# EAGLE design TiltyDuo (EAGLE 6.5.0)
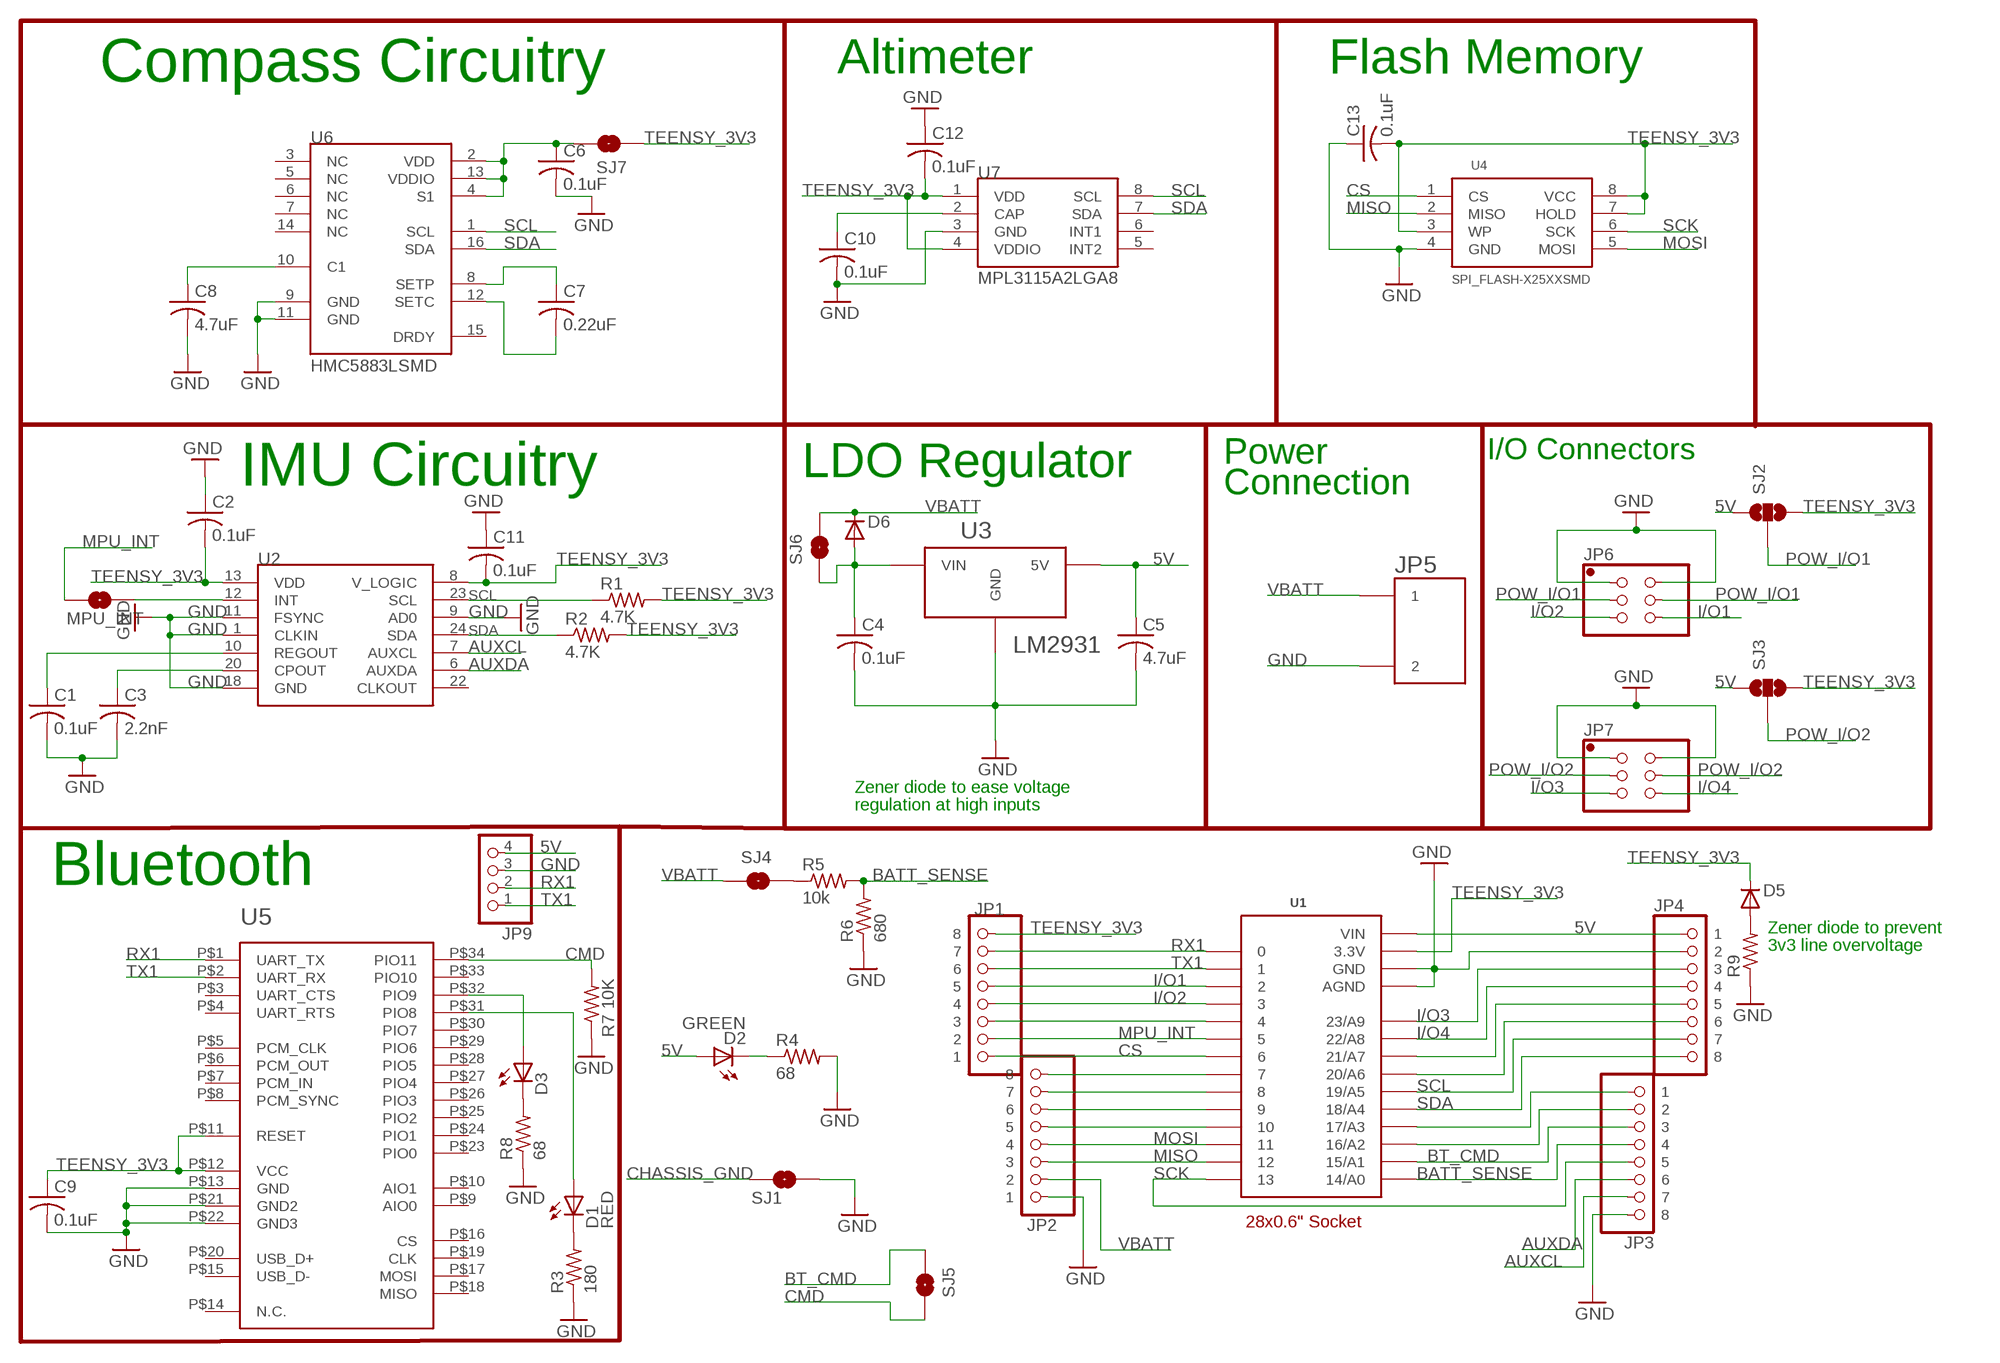
[diagram p0: schematic, sheet 1]

## Parts
C1  0.1uF  C-USC0603  [C0603]
C2  0.1uF  C-USC0603  [C0603]
C3  2.2nF  C-USC0603  [C0603]
C4  0.1uF  C-USC0603  [C0603]
C5  4.7uF  C-USC0603  [C0603]
C6  0.1uF  C-USC0603  [C0603]
C7  0.22uF  C-USC0603  [C0603]
C8  4.7uF  C-USC0603  [C0603]
C9  0.1uF  C-USC0603  [C0603]
C10  0.1uF  C-USC0603  [C0603]
C11  0.1uF  C-USC0603  [C0603]
C12  0.1uF  C-USC0603  [C0603]
C13  0.1uF  C-USC0603  [C0603]
D1  RED  LED-GREENLED-0805_NO_SILK  [LED-0805]
D2  GREEN  LED-GREENLED-0805_NO_SILK  [LED-0805]
D3  YELLOW  LED-GREENLED-0805_NO_SILK  [LED-0805]
D5  DIODESOT23  [SOT23-3]
D6  DIODE-DO214AA  [DO214AA]
JP1  8-PIN_HEADER  [8-PIN_RECEPTACLE_LOCK_NO-SS]
JP2  8-PIN_HEADER  [8-PIN_RECEPTACLE_LOCK_NO-SS]
JP3  8-PIN_HEADER  [8-PIN_RECEPTACLE_LOCK_NO-SS]
JP4  8-PIN_HEADER  [8-PIN_RECEPTACLE_LOCK_NO-SS]
JP5  2-POS_SMD_TERM_BLOCK  [2-POS_SMD_TERMINAL_BLOCK]
JP6  PINHD-2X32X03_NO_SS_LOCK  [2X03_NO_SS_LOCK]
JP7  PINHD-2X32X03_NO_SS_LOCK  [2X03_NO_SS_LOCK]
JP9  PINHD-1X41X04_NO_SS_LOCKING  [1X04_NO_SS_LOCKING]
MPU_INT  SOLDERJUMPERNO  [SJ_2S-NO]
R1  4.7K  R-US_R0603  [R0603]
R2  4.7K  R-US_R0603  [R0603]
R3  180  R-US_R0603  [R0603]
R4  68  R-US_R0603  [R0603]
R5  10k  R-US_R0603  [R0603]
R6  680  R-US_R0603  [R0603]
R7  10K  R-US_R0603  [R0603]
R8  68  R-US_R0603  [R0603]
R9  R-US_R0603  [R0603]
SJ1  SOLDERJUMPERNO  [SJ_2S-NO]
SJ2  SOLDERJUMPER_2WAYPASTE1&2  [SJ_3_PASTE1&2]
SJ3  SOLDERJUMPER_2WAYS  [SJ_3]
SJ4  SOLDERJUMPERTRACE  [SJ_2S-TRACE]
SJ5  SOLDERJUMPERTRACE  [SJ_2S-TRACE]
SJ6  SOLDERJUMPERTRACE  [SJ_2S-TRACE]
SJ7  SOLDERJUMPERTRACE  [SJ_2S-TRACE]
U1  TEENSY_3.0_OUTER-PINS28-DIP_SOCKET  [28-DIP]
U2  MPU-6050  [QFN-24]
U3  LM2931  [TO263]
U4  SPI_FLASH-X25XXSMD  [SO08]
U5  HC-09_BREAKOUT  [HC-09_BREAKOUT]
U6  HMC5883LSMD  [16LPCC]
U7  MPL3115A2LGA8  [LGA8]

## Nets
5V: C5.1 D2.1(A) JP4.P$1 JP9.4 SJ2.1 SJ3.1 U1.P$15(VIN) U3.P$3(5V)
AUXCL [I/O]: JP3.P$7 U2.7(AUXCL)
AUXDA [I/O]: JP3.P$6 U2.6(AUXDA)
BATT_SENSE: JP3.P$4 R5.2 R6.2 U1.P$27(14/A0)
BT_CMD: JP3.P$3 SJ5.1 U1.P$26(15/A1)
CHASSIS_GND: SJ1.1
CMD: R7.2 SJ5.2 U5.P$34(PIO11)
CS: JP1.P$1 U1.P$8 U4.1(CS)
GND: C1.2 C2.1 C3.2 C4.2 C5.2 C6.2 C8.2 C9.2 C10.2 C11.1 C12.1 C13.1 JP2.P$1 JP3.P$8 JP4.P$2 JP5.P$4 JP6.1 JP6.2 JP7.1 JP7.2 JP9.3 R3.1 R4.2 R6.1 R7.1 R8.1 R9.1 SJ1.2 U1.P$1(GND) U1.P$16(AGND) U2.1(CLKIN) U2.9(AD0) U2.11(FSYNC) U2.18(GND) U3.P$1(GND) U4.4(GND) U5.P$13(GND) U5.P$21(GND2) U5.P$22(GND3) U6.9(GND) U6.11(GND) U7.3(GND)
I/O1: JP1.P$5 JP6.6 U1.P$4
I/O2: JP1.P$4 JP6.5 U1.P$5
I/O3: JP4.P$3 JP7.5 U1.P$18(23/A9)
I/O4: JP4.P$4 JP7.6 U1.P$19(22/A8)
MISO: JP2.P$3 U1.P$14 U4.2(MISO)
MOSI: JP2.P$4 U1.P$13 U4.5(MOSI)
MPU_INT: JP1.P$2 MPU_INT.1 U1.P$7
N$1: C1.1 U2.10(REGOUT)
N$2: C3.1 U2.20(CPOUT)
N$3: D1.2(C) R3.2
N$5: C7.1 U6.8(SETP)
N$6: C7.2 U6.12(SETC)
N$7: JP1.P$3 U1.P$6
N$8: JP2.P$5 U1.P$12
N$9: R5.1 SJ4.2
N$10: JP3.P$1 U1.P$24(17/A3)
N$11: C8.1 U6.10(C1)
N$12: JP2.P$6 U1.P$11
N$13: D2.2(C) R4.1
N$14: D1.1(A) U5.P$31(PIO8)
N$16: MPU_INT.2 U2.12(INT)
N$17 [3.3V]: C6.1 SJ7.2 U6.2(VDD) U6.4(S1) U6.13(VDDIO)
N$18: JP4.P$5 U1.P$20(21/A7)
N$19: JP4.P$6 U1.P$21(20/A6)
N$21: C10.1 U7.2(CAP)
N$22: D5.1(A) R9.2
N$23: JP3.P$2 U1.P$25(16/A2)
N$24: D3.2(C) R8.2
POW_I/O1: JP6.3 JP6.4 SJ2.2
POW_I/O2: JP7.3 JP7.4 SJ3.2
RX1: JP1.P$7 JP9.2 U1.P$2 U5.P$1(UART_TX)
RX3: JP2.P$8 U1.P$9
SCK: JP3.P$5 U1.P$28 U4.6(SCK)
SCL [I/O]: JP4.P$7 R1.1 U1.P$22(19/A5) U2.23(SCL) U6.1(SCL) U7.8(SCL)
SDA [I/O]: JP4.P$8 R2.1 U1.P$23(18/A4) U2.24(SDA) U6.16(SDA) U7.7(SDA)
TEENSY_3V3 [3.3V]: C2.2 C9.1 C11.2 C12.2 C13.2 D5.3(C) JP1.P$8 R1.2 R2.2 SJ2.3 SJ3.3 SJ7.1 U1.P$17(3.3V) U2.8(V_LOGIC) U2.13(VDD) U4.3(WP) U4.7(HOLD) U4.8(VCC) U5.P$11(RESET) U5.P$12(VCC) U7.1(VDD) U7.4(VDDIO)
TX1: JP1.P$6 JP9.1 U1.P$3 U5.P$2(UART_RX)
TX3: JP2.P$7 U1.P$10
VBATT: C4.1 D6.A D6.C JP2.P$2 JP5.P$3 SJ4.1 SJ6.1 SJ6.2 U3.P$2(VIN)
YEL_LED: D3.1(A) U5.P$32(PIO9)
Unconnected: U2.22(CLKOUT) U5.P$3(UART_CTS) U5.P$4(UART_RTS) U5.P$5(PCM_CLK) U5.P$6(PCM_OUT) U5.P$7(PCM_IN) U5.P$8(PCM_SYNC) U5.P$9(AIO0) U5.P$10(AIO1) U5.P$14(N.C.) U5.P$15(USB_D-) U5.P$16(CS) U5.P$17(MOSI) U5.P$18(MISO) U5.P$19(CLK) U5.P$20(USB_D+) U5.P$23(PIO0) U5.P$24(PIO1) U5.P$25(PIO2) U5.P$26(PIO3) U5.P$27(PIO4) U5.P$28(PIO5) U5.P$29(PIO6) U5.P$30(PIO7) U5.P$33(PIO10) U6.3(NC) U6.5(NC) U6.6(NC) U6.7(NC) U6.14(NC) U6.15(DRDY) U7.5(INT2) U7.6(INT1)

## Notes on the sheet
- Compass Circuitry | Altimeter | Flash Memory
- Power | I/O Connectors
- IMU Circuitry | LDO Regulator
- Connection
- Zener diode to ease voltage
- regulation at high inputs
- Bluetooth
- Zener diode to prevent
- 3v3 line overvoltage
- 28x0.6" Socket

## Library data of the parts
C1 C6 C9 C10 C13 = resistor:C-US: CAPACITOR, American symbol; RATED_VOLTAGE: 2
C2 C4 C5 C11 C12 = resistor:C-US: CAPACITOR, American symbol
C3 = resistor:C-US: CAPACITOR, American symbol; RATED_VOLTAGE: 50
C7 C8 = resistor:C-US: CAPACITOR, American symbol; ESR: <200mOhms
D1-D3 = SparkFun-LED:LED-GREEN: Various green LEDs 0603- DIO-00821 LARGE- DIO-00862 LILYPAD- DIO-09910
D5 = SparkFun-DiscreteSemi:DIODE: Diode These are standard reverse protection diodes and small signal diodes. SMA package can handle up to about 1A. SOD-323 can handle about 200mA. What the SOD-323 package when ordering, there are some mfgs out there that are 5-pin packages.; PART#: BZX84C3V3LT1GOSCT-ND
D6 = diode:DIODE-: DIODE
JP1-JP4 = My Parts:8-PIN_HEADER
JP5 = My Parts:2-POS_SMD_TERM_BLOCK; PART#: 277-2337-1-ND; POSSIBLE_ALT: 009276002021106
JP6 JP7 = pinhead:PINHD-2X3: PIN HEADER
JP9 = pinhead:PINHD-1X4: PIN HEADER
MPU_INT SJ1 SJ4-SJ7 = SparkFun-Passives:SOLDERJUMPER: Solder Jumper Standard SMD solder jumper. Used to automate production. Two varients : Normally Open and Normally Closed are the same, but have different paste layers. NC will have a large amount of paste and should jumper during reflow.
R1-R9 = resistor:R-US_: RESISTOR, American symbol
SJ2 SJ3 = SparkFun-Passives:SOLDERJUMPER_2WAY: Solder Jumper 2 way solder jumper
U1 = My Parts:TEENSY_3.0_OUTER-PINS; COST: 0.28; PART#: AE10004-ND; PART#2: A28-LC-TR-R; PART#3: ED3052-5-ND
U2 = SparkFun-Sensors:MPU-6050: MPU-6000 - I2C address is 0x68 with AD0 low and 0x69 with AD0 high.
U3 = on-semiconductor:LM2931; COST: 0.53
U4 = SparkFun-DigitalIC:SPI_FLASH-X25XX: 8pin SPI Flash series x25xx. Works with devices like W25X32 and BR25L32; PART#: S25FL204K0TMFI043
U5 = csr:HC-09_BREAKOUT
U6 = SparkFun:HMC5883L: 3 Axis Digital Compass IC
U7 = SparkFun-Sensors:MPL3115A2: Altimeter/Pressure Sensor, I2C, 1.95V-3.6V supply, 50 to 110kPa

## Board
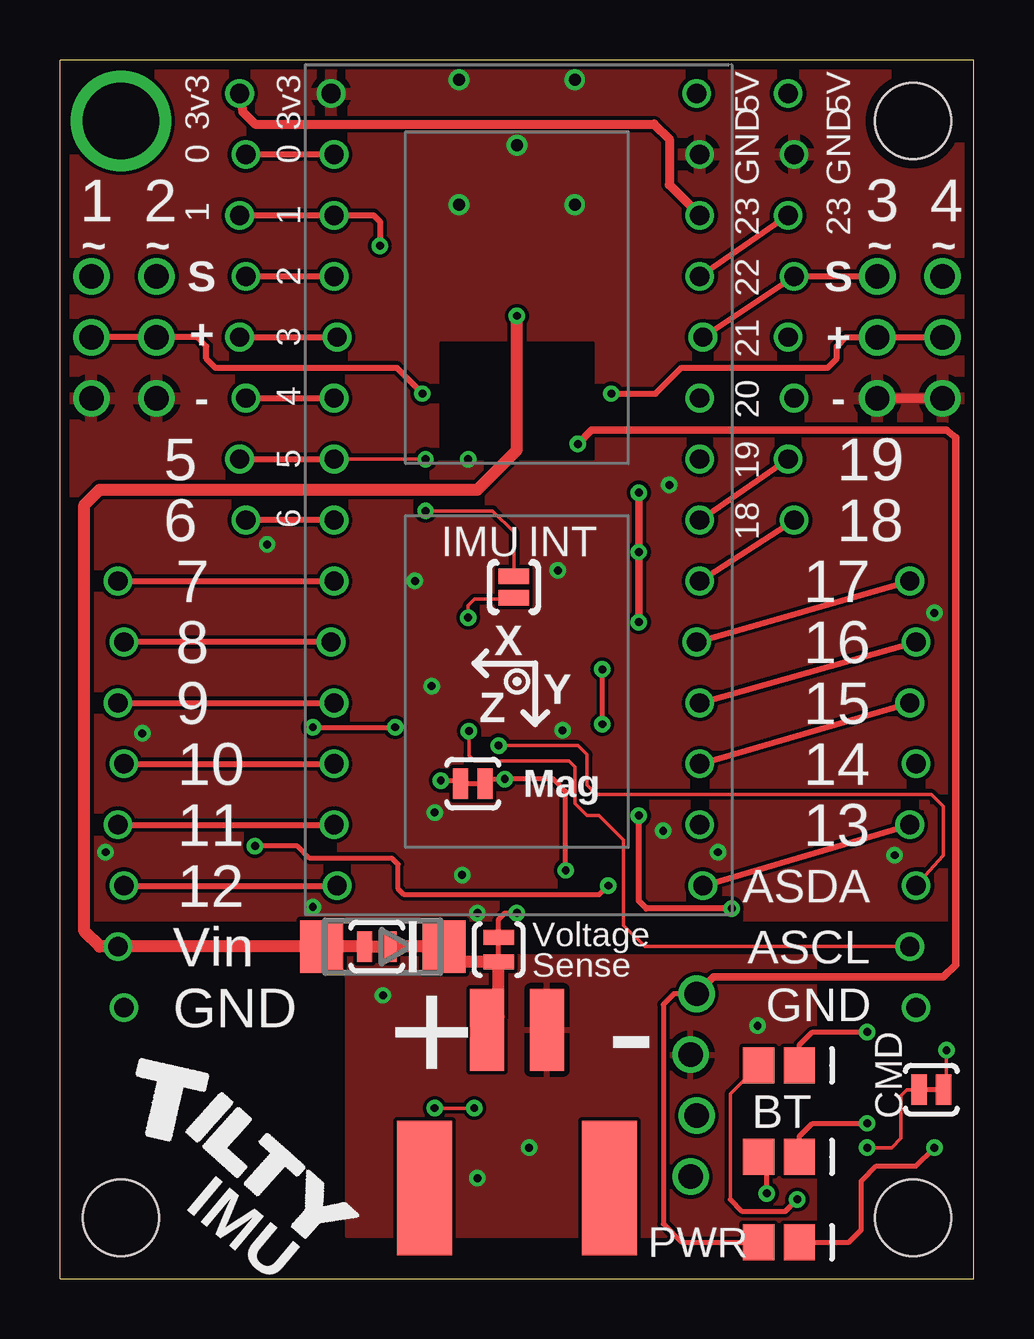
[diagram p1: board, top side]
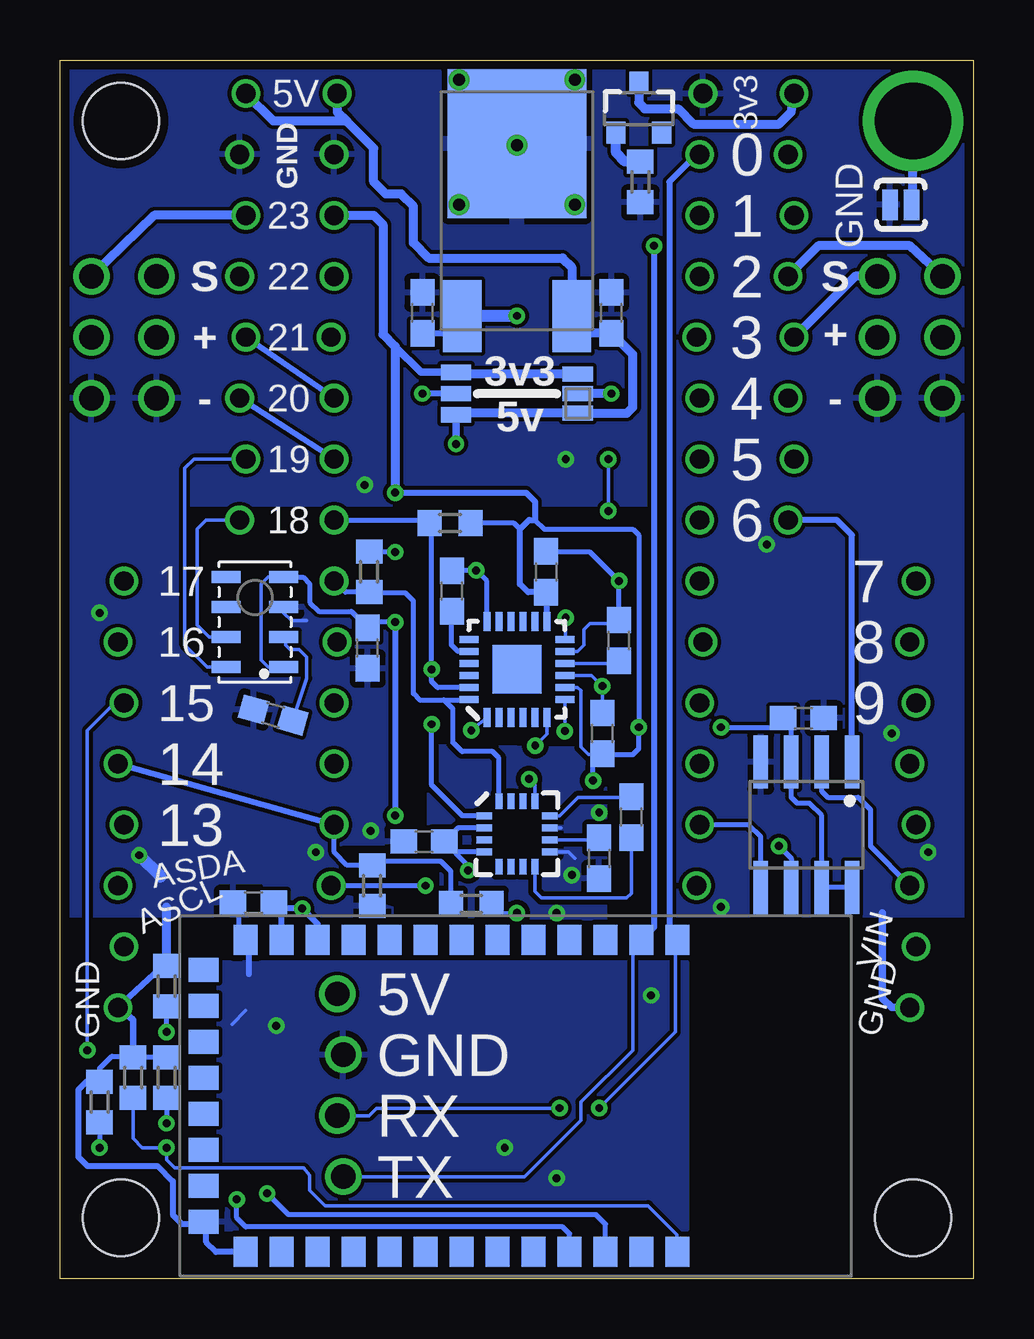
[diagram p2: board, bottom side, seen from below]

Size 38.1 x 50.8 mm. Coordinates in mm from the lower left corner, seen from the top.
Outline: 0,0 38.1,0 38.1,50.8 0,50.8 0,0
Copper layers (1*16): Top 0.0356mm / dielectric 1.5011mm / Bottom 0.0356mm
Design rules "LaenPCBOrder": minimum track width 6mil, minimum drill 13mil, track to track 6mil, track to pad 6mil, pad to pad 6mil, via to via 6mil, smd to smd 6mil, copper to edge 15mil, drill to drill 6mil, minimum pad ring 7mil, minimum via ring 7mil, stop-mask expansion 4mil, vias tented up to drill 0mil, thermal gap 10mil
Holes 3.17 mm at 35.56,48.26 35.56,2.54 2.54,2.54

### Footprints (pad centres in the part's own frame; a part is rotated, then mirrored left to right if it is on the bottom)
C0603 = smd 1.1 x 1: 1 -0.85,0; 2 0.85,0
LED-0805 = smd 1.3 x 1.5: 1 -0.85,0; 2 0.85,0
SOT23-3 = smd 0.8 x 0.9: 1 -0.95,-1; 2 0.95,-1; 3 0,1.1
DO214AA = smd 1.8 x 2.2: A 2.55,0; C -2.55,0
8-PIN_RECEPTACLE_LOCK_NO-SS = drill 0.8: P$1 -8.89,-0.127; P$2 -6.35,0.127; P$3 -3.81,-0.127; P$4 -1.27,0.127; P$5 1.27,-0.127; P$6 3.81,0.127; P$7 6.35,-0.127; P$8 8.89,0.127
2-POS_SMD_TERMINAL_BLOCK = smd 2.3 x 5.6: P$1 -3.85,-2.325; P$2 3.85,-2.325 | smd 1.4 x 3.4: P$3 -1.25,4.275; P$4 1.25,4.275
2X03_NO_SS_LOCK = drill 1.016: 1 -2.54,-1.359; 2 -2.54,1.359; 3 0,-1.359; 4 0,1.359; 5 2.54,-1.359; 6 2.54,1.359
1X04_NO_SS_LOCKING = drill 1.016: 1 -3.81,0.127; 2 -1.27,-0.127; 3 1.27,0.127; 4 3.81,-0.127
SJ_2S-NO = smd 0.635 x 1.27: 1 -0.45,0; 2 0.45,0
R0603 = smd 1 x 1.1: 1 -0.85,0; 2 0.85,0
SJ_3_PASTE1&2 = smd 0.635 x 1.27: 1 -0.813,0; 2 0,0; 3 0.813,0
SJ_3 = smd 0.635 x 1.27: 1 -0.889,0; 2 0,0; 3 0.889,0
SJ_2S-TRACE = smd 0.635 x 1.27: 1 -0.508,0; 2 0.508,0
28-DIP = drill 0.8: P$1 -7.747,16.51; P$2 -7.62,13.97; P$3 -7.62,11.43; P$4 -7.62,8.89; P$5 -7.493,6.35; P$6 -7.62,3.81; P$7 -7.62,1.27; P$8 -7.62,-1.27; P$9 -7.62,-3.81; P$10 -7.747,-6.35; P$11 -7.62,-8.89; P$12 -7.62,-11.43; P$13 -7.62,-13.97; P$14 -7.493,-16.51; P$15 7.493,16.51; P$16 7.62,13.97; P$17 7.62,11.43; P$18 7.62,8.89; P$19 7.747,6.35; P$20 7.62,3.81; P$21 7.62,1.27; P$22 7.62,-1.27; P$23 7.62,-3.81; P$24 7.493,-6.35; P$25 7.62,-8.89; P$26 7.62,-11.43; P$27 7.62,-13.97; P$28 7.747,-16.51
QFN-24 = smd 0.8 x 0.3: 1 -2,1.25; 2 -2,0.75; 3 -2,0.25; 4 -2,-0.25; 5 -2,-0.75; 6 -2,-1.25; 13 2,-1.25; 14 2,-0.75; 15 2,-0.25; 16 2,0.25; 17 2,0.75; 18 2,1.25 | smd 0.3 x 0.8: 7 -1.25,-2; 8 -0.75,-2; 9 -0.25,-2; 10 0.25,-2; 11 0.75,-2; 12 1.25,-2; 19 1.25,2; 20 0.75,2; 21 0.25,2; 22 -0.25,2; 23 -0.75,2; 24 -1.25,2 | smd 2.032 x 2.032: P$1 0,0
TO263 = smd 5.791 x 6.198: P$1 0,2.794 | smd 1.6 x 2.997: P$2 -2.286,-4.394; P$3 2.286,-4.394
SO08 = smd 0.61 x 2.21: 1 -1.905,-2.616; 2 -0.635,-2.616; 3 0.635,-2.616; 4 1.905,-2.616; 5 1.905,2.616; 6 0.635,2.616; 7 -0.635,2.616; 8 -1.905,2.616
HC-09_BREAKOUT = smd 1.25 x 1: P$1 -6.5,10.5; P$2 -6.5,9; P$3 -6.5,7.5; P$4 -6.5,6; P$5 -6.5,3; P$6 -6.5,4.5; P$7 -6.5,1.5; P$8 -6.5,0; P$9 -6.5,-1.5; P$10 -6.5,-3; P$11 -6.5,-4.5; P$12 -6.5,-6; P$13 -6.5,-7.5; P$22 6.5,-7.5; P$23 6.5,-6; P$24 6.5,-4.5; P$25 6.5,-3; P$26 6.5,-1.5; P$27 6.5,0; P$28 6.5,1.5; P$29 6.5,3; P$30 6.5,4.5; P$31 6.5,6; P$32 6.5,7.5; P$33 6.5,9; P$34 6.5,10.5 | smd 1 x 1.25: P$14 -5.25,-9.25; P$15 -3.75,-9.25; P$16 -2.25,-9.25; P$17 -0.75,-9.25; P$18 0.75,-9.25; P$19 2.25,-9.25; P$20 3.75,-9.25; P$21 5.25,-9.25
16LPCC = smd 0.65 x 0.28: 1 -1.37,0.75; 2 -1.37,0.25; 3 -1.37,-0.25; 4 -1.37,-0.75; 9 1.37,-0.75; 10 1.37,-0.25; 11 1.37,0.25; 12 1.37,0.75 | smd 0.28 x 0.65: 5 -0.75,-1.37; 6 -0.25,-1.37; 7 0.25,-1.37; 8 0.75,-1.37; 13 0.75,1.37; 14 0.25,1.37; 15 -0.25,1.37; 16 -0.75,1.37
LGA8 = smd 1.2 x 0.5: 1 -1.2,1.875; 2 -1.2,0.625; 3 -1.2,-0.625; 4 -1.2,-1.875; 5 1.2,-1.875; 6 1.2,-0.625; 7 1.2,0.625; 8 1.2,1.875

### Placement (x,y rotation side)
C1  14.8,26.61 90 bottom
C2  17.84,29.46 270 bottom
C3  21.75,28.66 90 bottom
C4  22.99,40.26 90 bottom
C5  15.11,40.26 90 bottom
C6  22.92,18.22 180 bottom
C7  14.29,19.24 90 bottom
C8  15.62,17.53 270 bottom
C9  30.04,15.68 180 bottom
C10  29.21,23.5 164.1 bottom
C11  15.49,22.73 270 bottom
C12  25.27,26.29 90 bottom
C13  7.11,23.37 180 bottom
D1  29.97,8.89 0 top
D2  29.97,1.52 0 top
D3  29.97,5.08 0 top
D5  13.97,48.77 0 bottom
D6  13.46,13.84 180 top
JP1  7.62,40.51 90 top
JP2  2.54,20.19 90 top
JP3  35.56,20.19 270 top
JP4  30.48,40.51 270 top
JP5  19.05,6.1 0 top
JP6  2.67,39.24 90 top
JP7  35.43,39.24 90 top
JP9  26.42,8.06 90 top
MPU_INT  18.92,28.83 270 top
R1  21.84,31.5 0 bottom
R2  25.21,29.46 90 bottom
R3  33.66,12.19 270 bottom
R4  36.45,7.37 90 bottom
R5  20.95,15.62 180 bottom
R6  25.08,16.38 90 bottom
R7  35.05,8.38 270 bottom
R8  33.66,8.38 270 bottom
R9  13.91,45.72 90 bottom
SJ1  3.05,44.77 180 bottom
SJ2  16.51,36.89 90 bottom
SJ3  21.59,36.89 90 bottom
SJ4  18.29,13.72 90 top
SJ5  36.32,7.87 180 top
SJ6  13.21,13.84 0 top
SJ7  17.21,20.64 0 top
U1  19.05,32.89 0 top
U2  19.05,25.4 90 bottom
U3  19.05,44.51 0 bottom
U4  6.99,18.92 180 bottom
U5  22.86,7.62 270 bottom
U6  19.05,18.54 0 bottom
U7  29.97,27.37 180 bottom

### Tracks (layer width: path | path; a pad name or v marks a point on that pad's centre or on a via)
5V  (via drill 0.33)
  Top 0.203: D2.1 25.91,1.52 25.15,2.29 25.15,11.43 25.59,11.87 JP9.4
  Top 0.305: 36.83,12.57 37.34,13.08
  Top 0.318: 37.34,13.08 37.34,35.05 36.96,35.37 22.16,35.37 v21.59,34.8 | 36.83,12.57 27.24,12.57 JP9.4
  Bottom 0.318: SJ3.1 v21.59,34.8
  Bottom 0.381: JP4.P$1 29.21,48.26 26.16,48.26 | SJ3.1 21.51,36.08 SJ2.1 14.46,36.08 14.22,36.32 14.22,38.52 C5.1 16.76,39.41 U3.P$3 16.76,42.16 17.14,42.55 22.73,42.55 23.37,43.18 23.37,44.7 23.88,45.21 24.51,45.21 25.02,45.72 25.02,47.12 26.04,48.13 26.16,48.26 | U1.P$15 26.54,48.64 26.16,48.26
  Bottom 0.508: 16.75,40.17 U3.P$3 16.71,40.17
AUXCL  (via drill 0.33)
  Top 0.152: JP3.P$7 24.38,13.84 23.5,14.73 23.5,18.29 22.48,19.3 21.97,19.3 21.46,19.81 21.46,21.34 21.21,21.59 17.27,21.59 17.05,21.81 v17.05,22.83
  Bottom 0.152: U2.7 v17.05,22.83
AUXDA  (via drill 0.33)
  Top 0.152: v18.29,22.23 21.59,22.23 21.97,21.84 21.97,20.57 22.35,20.19 36.32,20.19 36.83,19.68 36.83,17.65 JP3.P$6
  Bottom 0.152: 17.78,23.38 U2.6 17.8,22.71 v18.29,22.23
BATT_SENSE
  Bottom 0.203: 24.99,17.46 R6.2 | R6.2 26.12,17.23 26.67,17.78 U1.P$27 | R5.2 21.8,16.98 22.23,17.4 25.04,17.4 R6.2
  Bottom 0.254: U1.P$27 JP3.P$4
BT_CMD  (via drill 0.33)
  Top 0.152: v36.96,9.53 36.96,8 SJ5.1
  Top 0.254: U1.P$26 JP3.P$3
  Bottom 0.152: v36.96,9.53 36.96,22.86 35.81,24 JP3.P$3
CHASSIS_GND  (via drill 3.17)
  Bottom 0.381: SJ1.1 2.6,44.96 2.54,45.02 v2.54,48.26
CMD  (via drill 0.33)
  Top 0.152: v33.66,5.46 34.67,5.46 35.05,5.84 35.05,7.62 35.31,7.87 SJ5.2
  Bottom 0.152: U5.P$34 12.38,1.1 12.38,1.84 13.59,3.05 27.05,3.05 27.69,3.68 27.69,4.32 27.94,4.62 33.33,4.62 33.66,4.95 v33.66,5.46 34.67,5.46 35.05,5.84 R7.2 | 12.38,1.14 U5.P$34 | 12,0.64 U5.P$34
CS
  Top 0.254: U1.P$8 JP1.P$1
  Bottom 0.203: 5,21.46 U4.1
  Bottom 0.254: U4.1 5.08,30.99 5.71,31.62 JP1.P$1
GND  (via drill 0.33, 0.51 pad 0.18)
  Top 0.381: JP7.2 JP7.1
  Bottom 0.152: U2.9 15.94,25.15 v15.49,24.7 C11.1 | 30.92,10.6 30.35,11.18 | U6.9 16.9,17.79 16.64,17.53 | U2.11 16.52,26.15 16.26,26.42 16.26,27.05 16,27.3 15.07,27.3 C1.2 | U7.3 28.77,27.76 28.45,27.43 27.81,27.43 | U6.11 17.47,18.79 17.21,18.8 | 20.32,23.38 v20.95,22.86
  Bottom 0.203: U5.P$13 30.63,14.39 30.63,15.43 C9.2 | C2.1 17.82,30.29 16,30.29 v14.8,29.08 C1.2 | U2.18 20.3,29.08 v20.75,29.53 21.74,29.53 C3.2 | R8.1 R7.1 35.09,9.27 35.94,9.27 36.45,8.76 R4.2
  Bottom 0.254: 20.32,23.38 U2.1 | U5.P$22 31.6,1.12 32,1.52 32,2.26 U5.P$21 32.19,2.29 33.02,2.29 33.4,2.67 33.4,4.06 34.04,4.7 36.96,4.7 37.34,5.08 37.34,7.87 37,8.22 R4.2 | U5.P$13 | U5.P$13 30.36,13.98 | U5.P$13 30.23,14.11 30.23,12.7 | 30.57,14.33 U5.P$13 | 15.47,16.7 C8.2
  Bottom 0.274: R7.1 35.05,10.79 JP3.P$8 34.16,12.7 34,12.7 R3.1
  Bottom 0.318: JP2.P$1 3.43,11.3 3.81,11.68 3.81,15.24
  Bottom 0.381: 33.72,13.02 R3.1 33.66,15.49
  Bottom 0.508: 33.91,16.76 v34.8,17.65
  other vias: 19.05,47.24 16.64,44.77 21.46,44.77 21.46,49.97 16.64,49.97 15.62,19.43 17.4,4.19 13.46,11.81 16.76,16.83 25.15,18.67 25.4,33.08 8.64,30.61 17.02,34.16 27.43,17.78 19.56,5.46 1.91,17.78 3.43,22.73 29.08,10.54 17.4,15.24 10.54,15.49 36.45,27.75
  pour Top (isolate 0.127): 0,50.8 38.1,50.8 38.1,15.11 0,15.11
  pour Bottom: 0,32.26 0,50.8 38.1,50.8 38.1,32.26
  pour Bottom: 0,32.26 13.59,32.26 13.59,15.11 0,15.11
  pour Bottom: 24.13,32.26 37.97,32.26 38.1,15.11 24.26,15.11
  pour Top: 11.94,13.46 31.5,13.46 31.5,1.78 11.94,1.78
  pour Bottom: 11.94,2.03 11.94,13.21 31.5,13.21 31.5,12.57 31.5,2.03
  pour Bottom (isolate 0.203): 15.37,22.1 22.73,22.23 22.73,15.11 15.37,14.99
  pour Bottom: 16,50.29 22.1,50.29 22.1,43.94 16,43.94
I/O1
  Top 0.254: JP1.P$5 U1.P$4
  Bottom 0.381: JP6.6 2.67,43.05 6.48,43.05 JP1.P$5
I/O2
  Top 0.254: JP1.P$4 U1.P$5
  Bottom 0.381: JP6.5 4.95,41.78 JP1.P$4
I/O3
  Top 0.254: U1.P$18 JP4.P$3
  Bottom 0.381: JP7.5 34.16,44.32 JP4.P$3
I/O4
  Top 0.254: U1.P$19 JP4.P$4 JP7.6
MISO
  Top 0.254: JP2.P$3 U1.P$14
  Bottom 0.203: U4.2 6.35,20.32 6.1,20.07 4.83,20.07 4.32,19.56 4.32,18.03 JP2.P$3
MOSI
  Top 0.254: JP2.P$4 U1.P$13
  Bottom 0.203: U4.5 8.89,18.41 9.4,18.92 U1.P$13
MPU_INT  (via drill 0.33)
  Top 0.152: MPU_INT.1 18.92,31.11 18.03,32 v15.24,32 | v15.24,34.16 U1.P$7
  Top 0.254: JP1.P$2 U1.P$7
  Bottom 0.152: v15.24,32 v15.24,34.16
N$1
  Bottom 0.152: U2.10 14.9,25.65 C1.1
N$2
  Bottom 0.203: U2.20 21.52,26.15 21.78,26.42 21.78,27.79 C3.1
N$3  (via drill 0.33)
  Top 0.203: D1.2 30.82,9.74 31.37,10.29 v33.66,10.29
  Bottom 0.203: v33.66,10.29 R3.2
N$4
  cutout Bottom: 17.53,20.07 17.53,17.02 20.57,17.02 20.57,20.07
N$5
  Bottom 0.152: C7.1 14.29,16.07 14.48,15.88 18.03,15.88 18.3,16.14 U6.8
N$6
  Bottom 0.152: U6.12 17.28,19.29 16.51,20.07 14.31,20.07 C7.2
N$7
  Top 0.254: JP1.P$3 U1.P$6
N$8
  Top 0.254: JP2.P$5 U1.P$12
N$9  (via drill 0.33)
  Top 0.203: SJ4.2 18.29,14.99 18.54,15.24 v19.05,15.24
  Bottom 0.152: v19.05,15.24 19.72,15.24 R5.1
N$10
  Top 0.254: U1.P$24 JP3.P$1
N$11
  Bottom 0.152: U6.10 15.2,18.29 C8.1
N$12
  Top 0.254: JP2.P$6 U1.P$11
N$13  (via drill 0.33)
  Top 0.203: D2.2 32.89,1.52 33.4,2.03 33.4,4.06 34.04,4.7 35.69,4.7 v36.45,5.46
  Bottom 0.203: R4.1 v36.45,5.46
N$14  (via drill 0.33)
  Top 0.152: 27.94,3.3 27.94,7.71 D1.1
  Top 0.203: v30.73,3.3 30.23,2.79 28.45,2.79 27.94,3.3
  Bottom 0.203: U5.P$31 16.86,1.87 17.14,2.16 30.35,2.16 30.73,2.54 v30.73,3.3
N$16  (via drill 0.33)
  Top 0.152: v17.02,27.56 17.02,28.07 17.27,28.32 18.86,28.32 MPU_INT.2
  Bottom 0.152: v17.02,27.56 17.02,26.68 U2.12
N$17  (via drill 0.33)
  Top 0.152: 17.91,20.83 SJ7.2
  Top 0.203: v21.08,17.02 21.08,20.32 20.57,20.83 v18.54,20.83 17.91,20.83
  Bottom 0.152: U6.13 18.3,20.59 v18.54,20.83
  Bottom 0.203: U6.2 21.51,18.79 C6.1 | U6.4 21.64,17.79 C6.1 | v21.08,17.02 21.08,17.23 C6.1
N$18
  Bottom 0.254: U1.P$20 JP4.P$5
N$19
  Bottom 0.254: U1.P$21 JP4.P$6
N$20
  cutout Top: 15.88,38.99 22.23,38.99 22.23,34.16 15.88,34.16
N$21
  Bottom 0.152: 28.78,26.86 U7.2 28.7,26.8 28.7,26.42 28.51,26.23 28.13,26.23 27.81,25.91 27.81,25.02 C10.1
N$22
  Bottom 0.406: R9.2 14.57,46.57 14.92,46.93 D5.1
N$23
  Top 0.254: U1.P$25 JP3.P$2
N$24  (via drill 0.33)
  Top 0.203: D3.2 30.82,5.93 31.37,6.48 v33.66,6.48
  Bottom 0.203: R8.2 v33.66,6.48
N$25
  cutout Bottom: 29.72,15.24 29.72,16.38 30.35,16.38 30.35,15.24
N$26
  cutout Bottom: 22.35,15.11 26.29,16.13 26.29,17.97 22.35,17.97
N$28
  cutout Bottom: 28.57,29.84 31.37,29.84 31.37,25.15 28.57,25.15
POW_I/O1  (via drill 0.33)
  Top 0.254: JP6.4 JP6.3 5.71,39.24 6.1,38.86 6.1,38.35 6.48,37.97 14.03,37.97 v15.11,36.89
  Bottom 0.381: v15.11,36.89 SJ2.2
POW_I/O2  (via drill 0.33)
  Top 0.254: JP7.3 JP7.4 32.77,39.24 32.38,38.86 32.38,38.35 32,37.97 25.91,37.97 24.83,36.89 v22.99,36.89
  Bottom 0.254: SJ3.2 v22.99,36.89
RX1  (via drill 0.33)
  Top 0.152: v17.27,7.11 v15.62,7.11
  Top 0.254: JP1.P$7 U1.P$2
  Bottom 0.152: 12.38,14.1 U5.P$1 12.45,14.03 12.45,10.29 v15.62,7.11 | JP9.2 25.21,6.79 24.89,7.11 v17.27,7.11
  Bottom 0.254: U1.P$2 11.56,46.86 12.7,45.72 12.7,14.59 U5.P$1
RX3
  Top 0.254: JP2.P$8 U1.P$9
SCK  (via drill 0.33)
  Top 0.203: v22.86,16.38 22.48,16 14.35,16 14.1,16.26 14.1,17.27 13.84,17.53 10.41,17.53 9.91,18.03 v8.13,18.03
  Top 0.254: U1.P$28 JP3.P$5
  Bottom 0.203: v22.86,16.38 U1.P$28 | v8.13,18.03 7.62,17.53 U4.6
SCL  (via drill 0.33)
  Top 0.203: v22.61,23.11 v22.61,25.4
  Top 0.254: U1.P$22 JP4.P$7
  Bottom 0.152: U7.8 31.97,25.49 32.89,26.42 32.89,33.78 32.51,34.16 JP4.P$7
  Bottom 0.203: U2.23 21.06,24.64 22.35,24.64 22.61,24.89 v22.61,25.4 22.61,31.41 R1.1 22.82,31.62 U1.P$22 | U6.1 21.32,19.29 22.61,20.57 v22.61,23.11
SDA
  Top 0.254: U1.P$23 JP4.P$8
  Bottom 0.152: U7.7 31.89,26.74 32.38,27.24 32.38,31.24 32,31.62 JP4.P$8
  Bottom 0.203: 22.1,24.13 23.11,24.13 23.37,24.38 23.37,28.26 23.69,28.57 25.17,28.57 R2.1 26.2,28.61 U1.P$23 | 22.1,24.13 21.07,24.13 U2.24 | U6.16 19.8,21.7 20.07,21.97 21.34,21.97 21.72,22.35 21.72,23.75 22.1,24.13
TEENSY_3V3  (via drill 0.33)
  Top 0.203: v10.54,22.99 v13.97,22.99 | v15.88,20.77 16.57,20.77 SJ7.1
  Top 0.254: v28,15.43 24.45,15.43 24.13,15.75 v24.13,19.3
  Top 0.305: v24.13,32.77 v24.13,30.29 v24.13,27.37
  Top 0.381: U1.P$17 25.4,45.59 25.4,47.5 24.77,48.13 8.13,48.13 7.62,48.64 JP1.P$8
  Bottom 0.152: U2.8 16.52,24.65 16.38,24.51 16.38,22.16 16.07,21.84 15.53,21.84 | U7.1 29.43,25.49 29.72,25.78 29.72,28.96 29.43,29.24 U7.4 | 15.88,21.5 15.53,21.84 | 15.53,21.84 C11.2
  Bottom 0.203: 18.29,31.62 17.91,31.24 14.22,31.24 13.97,30.99 v13.97,22.99 13.97,22.1 14.22,21.84 15.53,21.84 | v24.13,27.37 25.04,27.37 C12.2 25.95,27.81 27.3,27.81 27.69,28.19 27.69,28.96 27.97,29.24 U7.4 28.74,29.34 | 18.92,31.24 19.18,31.5 R1.2 | v24.13,30.29 25.18,30.29 R2.2 | U4.8 U4.7 6.35,19.3 6.86,19.81 7.37,19.81 7.62,20.07 U4.3 7.62,23.37 C13.2 8.09,22.99 v10.54,22.99 | v15.88,20.77 15.88,21.5 C11.2
  Bottom 0.254: U2.13 17.8,28.57 C2.2 18.58,28.61 18.92,28.96 18.92,31.24 18.54,31.62 18.29,31.62 18.29,32.38 18.67,32.77 v24.13,32.77 | U5.P$11 27.36,14.79 v28,15.43 28.93,15.43 C9.1 28.86,15.36 U5.P$12 | v24.13,27.37 v24.13,19.3
  Bottom 0.318: SJ3.3 23.05,37.78 24.13,38.86
  Bottom 0.381: v24.13,32.77 24.13,38.86 24.64,39.37 24.64,43.94 25.02,44.32 U1.P$17 | D5.3 13.97,49.02 13.72,48.77 12.32,48.77 11.68,48.13 8.13,48.13 7.62,48.64 JP1.P$8 | SJ2.3 21.51,37.71 SJ3.3
TX1  (via drill 0.33)
  Top 0.254: v13.34,43.05 13.34,44.07 13.08,44.32 U1.P$3 JP1.P$6
  Bottom 0.152: JP9.1 18.73,4.25 16.38,6.6 16.38,7.37 14.22,9.53 14.22,13.76 U5.P$2
  Bottom 0.254: v13.34,43.05 13.34,14.64 U5.P$2
TX3
  Top 0.254: U1.P$10 JP2.P$7
VBATT  (via drill 0.33)
  Top 0.508: v19.05,40.13 19.05,34.54 17.4,32.89 1.65,32.89 1.02,32.26 1.02,14.48 1.65,13.84 JP2.P$2 D6.A SJ6.1 SJ6.2 D6.C 16.65,13.21 SJ4.1 18.29,10.92 17.8,10.43 JP5.P$3
  Bottom 0.254: C4.1 22.05,39.41 U3.P$2
  Bottom 0.508: v19.05,40.13 21.34,40.13 U3.P$2
YEL_LED  (via drill 0.33)
  Top 0.203: v29.46,3.56 29.46,4.74 D3.1
  Bottom 0.203: U5.P$32 15.36,2.28 15.75,2.67 28.57,2.67 v29.46,3.56

### Text on the board
tNames: 5V | 5V | 3v3 | 3v3 | 0 | 0 | GND | GND | 1 | 2 | 3 | 4 | 1 | 1 | 23 | 23 | ~ | ~ | S | S | ~ | ~ | 2 | 22 | + | 3 | + | 21 | - | - | 4 | 20 | 5 | 5 | 19 | 19 | 6 | 18 | 6 | IMU | INT | 18 | 17 | 7 | 16 | 8 | X | Y | 15 | 9 | Z | 10 | 14 | Mag | 13 | 11 | ASDA | 12 | Vin | Voltage | ASCL | Sense | GND | GND | + | - | BT | CMD | IMU | PWR
bNames: 5V | 3v3 | GND | 0 | GND | 1 | 23 | S | 2 | 22 | S | + | 3 | 21 | + | 3v3 | - | 4 | 20 | - | 5v | 5 | 19 | 6 | 18 | 7 | 17 | 8 | 16 | 9 | 15 | 14 | 13 | ASDA | ASCL | VIN | 5V | GND | GND | GND | RX | TX